# Altium schematic sheet Sheet2.SchDoc: Ultrasonic Distance Meter
size A4; Date: 29.08.2025; Author: Olexandr Makedonskyi; CompanyName: AJAX; DrawnBy: Olexandr Makedonskyi; DocumentNumber: 1; Revision: 1.0; SheetNumber: 1; SheetTotal: 1
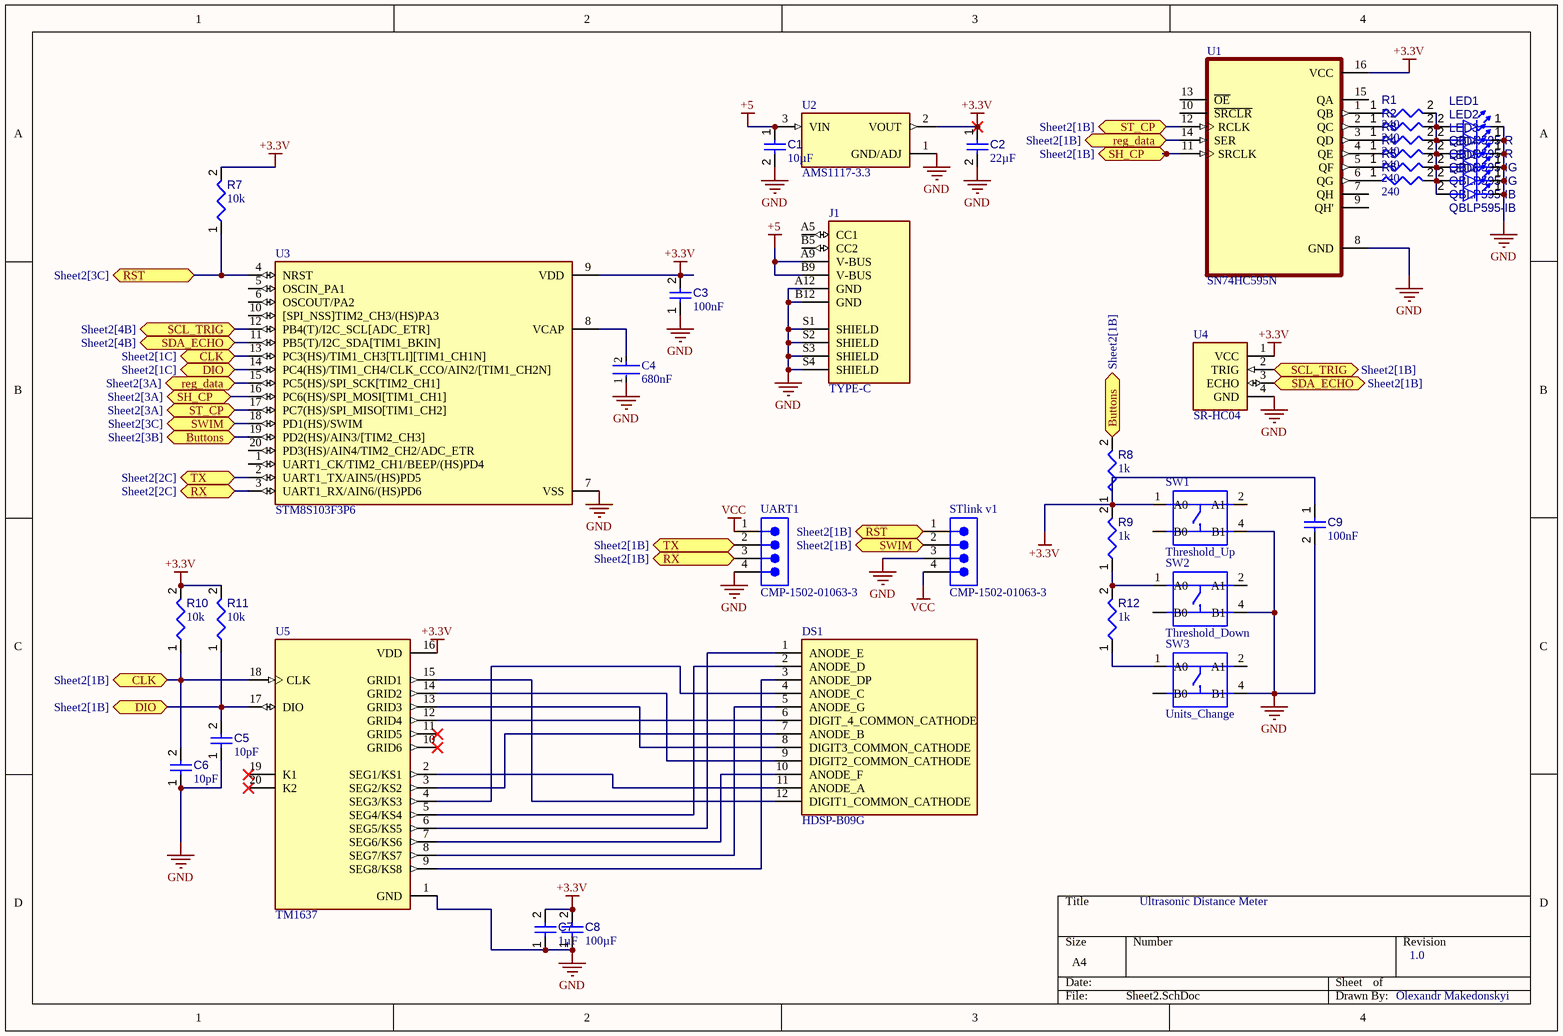
[diagram p0: Sheet2.SchDoc]

## Parts
C1  value 10µF  [CAPC2013X135X45NL10T25]  (hidden comment: Capacitor 10 uF +/- 10% 16 V 0805)
C2  value 22µF  [CAPC0805(2012)145_L]  (hidden comment: Capacitor 22µF +/-40% 16V 0805)
C3  value 100nF  [CAPC0402(1005)60_L]  (hidden comment: Capacitor 100nF +/-20% 10V 0402)
C4  680nF  [FP-C1608-080-0_1-IPC_B]
C5  value 10pF  [CAPC1608X87X35NL15T15]  (hidden comment: Capacitor 10 pF +/- 0.25 pF 50 V 0603)
C6  value 10pF  [CAPC1608X87X35NL15T15]  (hidden comment: Capacitor 10 pF +/- 0.25 pF 50 V 0603)
C7  value 1µF  [CAPC0603(1608)100_L]  (hidden comment: Capacitor 1µF +/-0.1% 25V 0603)
C8  value 100µF  [CAPC0805(2012)145_L]  (hidden comment: Capacitor 100µF +/-20% 6.3V 0805)
C9  value 100nF  [CAPC0402(1005)60_L]  (hidden comment: Capacitor 100nF +/-20% 10V 0402)
DS1  HDSP-B09G  [AVAGO_HDSP-B09G]
J1  TYPE-C  [CUI_UJC-HP-3-SMT-TR]
LED1  QBLP595-R  [QTB-QBLP595_V]
LED2  QBLP595-R  [QTB-QBLP595_V]
LED3  QBLP595-IG  [QTB-QBLP595_V]
LED4  QBLP595-IG  [QTB-QBLP595_V]
LED5  QBLP595-IB  [QTB-QBLP595_V]
LED6  QBLP595-IB  [QTB-QBLP595_V]
R1  value 240  [RESC0402(1005)_L]  (hidden comment: Resistor 240R +/-5 % 0402 63 mW)
R2  value 240  [RESC0402(1005)_L]  (hidden comment: Resistor 240R +/-5 % 0402 63 mW)
R3  value 240  [RESC0402(1005)_L]  (hidden comment: Resistor 240R +/-5 % 0402 63 mW)
R4  value 240  [RESC0402(1005)_L]  (hidden comment: Resistor 240R +/-5 % 0402 63 mW)
R5  value 240  [RESC0402(1005)_L]  (hidden comment: Resistor 240R +/-5 % 0402 63 mW)
R6  value 240  [RESC0402(1005)_L]  (hidden comment: Resistor 240R +/-5 % 0402 63 mW)
R7  value 10k  [RESC0402(1005)_L]  (hidden comment: 10KR2F)
R8  value 1k  [RESC0402(1005)_L]  (hidden comment: 1KR2J)
R9  value 1k  [RESC0402(1005)_L]  (hidden comment: 1KR2J)
R10  value 10k  [RESC3216X60X45ML15T20]  (hidden comment: Resistor 10k +/-1% 1206 250 mW)
R11  value 10k  [RESC3216X60X45ML15T20]  (hidden comment: Resistor 10k +/-1% 1206 250 mW)
R12  value 1k  [RESC0402(1005)_L]  (hidden comment: 1KR2J)
STlink_v1  CMP-1502-01063-3  [61300411021]
SW1  Threshold_Up  [SW4-SMD-5.2X5.2X1.5MM]
SW2  Threshold_Down  [SW4-SMD-5.2X5.2X1.5MM]
SW3  Units_Change  [SW4-SMD-5.2X5.2X1.5MM]
U1  SN74HC595N  [DIP794W45P254L1969H508Q16]
U2  AMS1117-3.3  [SOT229P700X180-4N]
U3  STM8S103F3P6  [SOP65P640X120-20N]
U4  SR-HC04  [MODULE_4007]
U5  TM1637  [DIP778W43P254L2612H431Q20N]
UART1  CMP-1502-01063-3  [61300411021]

## Ports
Buttons (bidir, see Sheet2[1B]), Buttons (bidir, see Sheet2[3B]), CLK (bidir, see Sheet2[1B]), CLK (bidir, see Sheet2[1C]), DIO (bidir, see Sheet2[1B]), DIO (bidir, see Sheet2[1C]), reg_data (bidir, see Sheet2[1B]), reg_data (bidir, see Sheet2[3A]), RST (bidir, see Sheet2[1B]), RST (bidir, see Sheet2[3C]), RX (bidir, see Sheet2[1B]), RX (bidir, see Sheet2[2C]), SCL_TRIG (bidir, see Sheet2[1B]), SCL_TRIG (bidir, see Sheet2[4B]), SDA_ECHO (bidir, see Sheet2[1B]), SDA_ECHO (bidir, see Sheet2[4B]), SH_CP (bidir, see Sheet2[1B]), SH_CP (bidir, see Sheet2[3A]), ST_CP (bidir, see Sheet2[1B]), ST_CP (bidir, see Sheet2[3A]), SWIM (bidir, see Sheet2[1B]), SWIM (bidir, see Sheet2[3C]), TX (bidir, see Sheet2[1B]), TX (bidir, see Sheet2[2C])

## Nets
+3.3V: C2.1 C3.2 C7.2 C8.2 C9.1 R7.2 R8.1 R9.2 R10.2 R11.2 SW1.1(A0) U1.16(VCC) U2.2(VOUT) U3.9(VDD) U4.1(VCC) U5.16(VDD)
+5: C1.1 J1.A9(V-BUS) J1.B9(V-BUS) U2.3(VIN)
GND: C1.2 C2.2 C3.1 C4.1 C5.1 C6.1 C7.1 C8.1 C9.2 J1.A12(GND) J1.B12(GND) J1.S1(SHIELD) J1.S2(SHIELD) J1.S3(SHIELD) J1.S4(SHIELD) LED1.1(K) LED2.1(K) LED3.1(K) LED4.1(K) LED5.1(K) LED6.1(K) STlink_v1.3 SW1.4(B1) SW2.4(B1) SW3.4(B1) U1.8(GND) U2.1(GND/ADJ) U3.7(VSS) U4.4(GND) U5.1(GND) UART1.4
VCC: STlink_v1.4 UART1.1
Buttons: R8.2 U3.19(PD2(HS)/AIN3/[TIM2_CH3]) ; port Buttons
CLK: C6.2 R10.1 U3.13(PC3(HS)/TIM1_CH3[TLI][TIM1_CH1N]) U5.18(CLK) ; port CLK
DIO: C5.2 R11.1 U3.14(PC4(HS)/TIM1_CH4/CLK_CCO/AIN2/[TIM1_CH2N]) U5.17(DIO) ; port DIO
reg_data: U1.14(SER) U3.15(PC5(HS)/SPI_SCK[TIM2_CH1]) ; port reg_data
RST: R7.1 STlink_v1.1 U3.4(NRST) ; port RST
RX: U3.3(UART1_RX/AIN6/(HS)PD6) UART1.3 ; port RX
SCL_TRIG: U3.12(PB4(T)/I2C_SCL[ADC_ETR]) U4.2(TRIG) ; port SCL_TRIG
SDA_ECHO: U3.11(PB5(T)/I2C_SDA[TIM1_BKIN]) U4.3(ECHO) ; port SDA_ECHO
SH_CP: U1.11(SRCLK) U3.16(PC6(HS)/SPI_MOSI[TIM1_CH1]) ; port SH_CP
ST_CP: U1.12(RCLK) U3.17(PC7(HS)/SPI_MISO[TIM1_CH2]) ; port ST_CP
SWIM: STlink_v1.2 U3.18(PD1(HS)/SWIM) ; port SWIM
TX: U3.2(UART1_TX/AIN5/(HS)PD5) UART1.2 ; port TX
NetC4_2: C4.2 U3.8(VCAP)
NetDS1_1: DS1.1(ANODE_E) U5.6(SEG5/KS5)
NetDS1_2: DS1.2(ANODE_D) U5.5(SEG4/KS4)
NetDS1_3: DS1.3(ANODE_DP) U5.9(SEG8/KS8)
NetDS1_4: DS1.4(ANODE_C) U5.4(SEG3/KS3)
NetDS1_5: DS1.5(ANODE_G) U5.8(SEG7/KS7)
NetDS1_6: DS1.6(DIGIT_4_COMMON_CATHODE) U5.12(GRID4)
NetDS1_7: DS1.7(ANODE_B) U5.3(SEG2/KS2)
NetDS1_8: DS1.8(DIGIT3_COMMON_CATHODE) U5.13(GRID3)
NetDS1_9: DS1.9(DIGIT2_COMMON_CATHODE) U5.14(GRID2)
NetDS1_10: DS1.10(ANODE_F) U5.7(SEG6/KS6)
NetDS1_11: DS1.11(ANODE_A) U5.2(SEG1/KS1)
NetDS1_12: DS1.12(DIGIT1_COMMON_CATHODE) U5.15(GRID1)
NetLED1_2: LED1.2(A) LED2.2(A) LED3.2(A) LED4.2(A) LED5.2(A) LED6.2(A) R1.2 R2.2 R3.2 R4.2 R5.2 R6.2
NetR1_1: R1.1 U1.1(QB)
NetR2_1: R2.1 U1.2(QC)
NetR3_1: R3.1 U1.3(QD)
NetR4_1: R4.1 U1.4(QE)
NetR5_1: R5.1 U1.5(QF)
NetR6_1: R6.1 U1.6(QG)
NetR9_1: R9.1 R12.2 SW2.1(A0)
NetR12_1: R12.1 SW3.1(A0)

Not connected (* = marked no-connect by the designer): J1 A5(CC1) B5(CC2); SW1 2(A1) ?1(B0); SW2 2(A1) ?1(B0); SW3 2(A1) ?1(B0); U1 7(QH) 9(QH') 10(~{SRCLR}) 13(~{OE}) 15(QA); U3 1(UART1_CK/TIM2_CH1/BEEP/(HS)PD4) 5(OSCIN_PA1) 6(OSCOUT/PA2) 10([SPI_NSS]TIM2_CH3/(HS)PA3) 20(PD3(HS)/AIN4/TIM2_CH2/ADC_ETR); U5 10(GRID6)* 11(GRID5)* 19(K1)* 20(K2)*

## Notes on the sheet
- Ultrasonic Distance Meter
- 1.0
- Olexandr Makedonskyi

## Library data of the parts
C1 = CMP-001-00015-6: Chip Capacitor, 10 uF, +/- 10%, 16 V, 0805 (2012 Metric); Voltage Rating: 16V; Capacitor Type: Ceramic; RoHS Compliant: True; Max Operating Temperature: 85°C; Min Operating Temperature: -55°C; Mounting Technology: SM; Tolerance: 10%; Case/Package: 0805; Pins: 2
C2 = CMP-001-00081-4: Chip Capacitor, 22µF +/-40%, 16V, 0805, Thickness 1.45 mm; Tolerance: 5%; Voltage Rating: 16V; Mounting Technology: SMT; Pins: 2; Max Operating Temperature: 85°C; Case/Package: 0805; Min Operating Temperature: -55°C
C3 C9 = CMP-001-00061-3: Chip Capacitor, 100nF +/-20%, 10V, 0402, Thickness 0.6 mm; Tolerance: 20%; Mounting Technology: SMT; Voltage Rating: 10V; Max Operating Temperature: 85°C; Pins: 2; Case/Package: 0402; Min Operating Temperature: -55°C
C4 = CMP-08246-004096-1: Multilayer Ceramic Capacitors 680nF ±20% 35V JB SMD 0603; Packaging: Tape and Reel; Case/Package: 0603; Mount: Surface Mount; Width: 0.031inch; Length: 0.063inch; Min Operating Temperature: -25°C; Series: C; RoHS Compliant: Yes; Lead Free: Lead Free; Max Operating Temperature: 85°C; Case Code (Imperial): 0603; Thickness: 0.035inch; Voltage Rating: 35V; Case Code (Metric): 1608; Dielectric Material: Ceramic; Tolerance: 20%; Package Quantity: 4000; Capacitance: 680nF; Voltage Rating (DC): 35V
C5 C6 = CMP-001-00012-6: Chip Capacitor, 10 pF, +/- 0.25 pF, 50 V, 0603 (1608 Metric); Tolerance: 0.25%; Capacitor Type: Ceramic; Voltage Rating: 50V; Max Operating Temperature: 125°C; RoHS Compliant: True; Mounting Technology: SM; Pins: 2; Case/Package: 0603; Min Operating Temperature: -55°C
C7 = CMP-001-00055-4: Chip Capacitor, 1µF +/-0.1%, 25V, 0603, Thickness 1 mm; Tolerance: 20%; Min Operating Temperature: -55°C; Max Operating Temperature: 85°C; Voltage Rating: 25V; Mounting Technology: SMT; Case/Package: 0603; Pins: 2
C8 = CMP-001-00054-4: Chip Capacitor, 100µF +/-20%, 6.3V, 0805, Thickness 1.45 mm; Tolerance: 10%; Min Operating Temperature: -55°C; Max Operating Temperature: 85°C; Pins: 2; Mounting Technology: SMT; Case/Package: 0805; Voltage Rating: 6.3V
DS1 = CMP-007-00036-1: Display Modules - LED Character and Numeric Green 7-Segment Clock 4 Character Common Cathode 2.2V 20mA 0.752 H x 2.016 W x 0.315 D (19.10mm x 51.20mm x 8.00mm) 12-DIP (0.600, 15.24mm); MF: Broadcom / Avago; Check_prices: https://www.snapeda.com/parts/HDSP-B09G/Broadcom/view-part/?ref=eda; SnapEDA_Link: https://www.snapeda.com/parts/HDSP-B09G/Broadcom/view-part/?ref=snap; MP: HDSP-B09G; Pins: 12; Value: *; Design Item ID: HDSP-B09G; Component Type: Standard; Case/Package: None; Source: HDSP-B09G.SchLib
J1 = CMP-021-000000-1: Source: UJC-HP-3-SMT-TR.SchLib; Design Item ID: UJC-HP-3-SMT-TR; Value: *; Package: None; MP: UJC-HP-3-SMT-TR; Availability: Unavailable; Pin Count: 10; Component Type: Standard; Price: None
LED1 LED2 = CMP-007-00040-3: Chip LED 0402, Red, 0.02 A, 2.0 to 2.5 V, -40 to 80 degC, 2-Pin SMD, RoHS, Tape and Reel; Colour: Red; RoHS Compliant: Yes; Case/Package: 0402; Pins: 2; Mounting Technology: SMT
LED3 LED4 = CMP-007-00041-3: Chip LED 0402, Green, 0.02 A, 3.1 to 3.7 V, -40 to 80 degC, 2-Pin SMD, RoHS, Tape and Reel; Case/Package: 0402; Colour: Green; Mounting Technology: SMT; Pins: 2; RoHS Compliant: Yes
LED5 LED6 = CMP-007-00042-3: Chip LED 0402, Blue, 0.02 A, 3.1 to 3.7 V, -40 to 80 degC, 2-Pin SMD, RoHS, Tape and Reel; RoHS Compliant: Yes; Colour: Blue; Pins: 2; Case/Package: 0402; Mounting Technology: SMT
R1-R6 = CMP-009-00155-3: Chip Resistor, 240 Ohms, +/-5 %, 63 mW, -55 to 155 degC, 0402; Power: 63mW; Tolerance: 5%; Case/Package: 0402; Pins: 2; Max Operating Temperature: 155°C; Min Operating Temperature: -55°C
R7 = CMP-009-00066-2: 10K 0.063W 1% 0402 (1005 Metric)  SMD; Power: 63mW; Case/Package: 0402; Mounting Technology: SMT; Pins: 2; Tolerance: 1%
R8 R9 R12 = CMP-009-00075-2: 1K 0.063W 5% 0402 (1005 Metric)  SMD; Power: 63mW; Pins: 2; Mounting Technology: SMT; Case/Package: 0402; Tolerance: 5%
R10 R11 = CMP-009-00016-5: Chip Resistor, 10 KOhm, +/- 1%, 0.25 W, -55 to 155 degC, 1206 (3216 Metric); Power: 250mW; Voltage Rating: 200V; Pins: 2; Max Operating Temperature: 155°C; Tolerance: 1%; RoHS Compliant: True; Case/Package: 1206; Min Operating Temperature: -55°C; Mounting Technology: SM
STlink_v1 UART1 = CMP-007-000000-1: NexarPartId: 31153320; Number of Positions: 4; Connector Type: Male Pin; Gender: Male; Current Rating: 3A; Pitch: 2.54mm; Contact Resistance: 20m?; Operating Supply Voltage: 250V; REACH SVHC: Unknown; Contact Mating Length: 5.9944mm; Termination: Solder; Pin Count: 4; Mount: Through Hole; Number of Rows: 1; Number of Pins: 4; Contact Material: Copper; Color: Black; Contact Plating: Gold; Design Item ID: CMP-1502-01063-3; Component Type: Standard; Source: Components - 25.08.25 - 11.48.SchLib; RoHS: Compliant; Lead Pitch: 2.54mm; Number of Contacts: 4
SW1-SW3 = CMP-011-00013-1: Switch Tactile N.O. SPST Button Gull Wing 0.05A 12VDC 3.43N SMD T/R; MF: ALPS; MP: SKQGAKE010; Price: None; Pins: 4; SnapEDA_Link: https://www.snapeda.com/parts/SKQGAKE010/ALPS/view-part/51324/?ref=snap; Source: SnapEDAsch.SchLib; Value: *; Availability: Unavailable; Design Item ID: SMD-BUTTON(4P-5.2X5.2X1.5MM-SKQGAKE010); Component Type: Standard; Case/Package: None
U1 = CMP-009-000000-1: 8-bit shift registers with 3-state output registers; MF: Texas Instruments; MP: SN74HC595N; Component Type: Standard; Package: PDIP-16 Texas Instruments; Check_prices: https://www.snapeda.com/parts/SN74HC595N/Texas+Instruments/view-part/?ref=eda; Design Item ID: SN74HC595N; SnapEDA_Link: https://www.snapeda.com/parts/SN74HC595N/Texas+Instruments/view-part/?ref=snap; Pin Count: 16; Value: *; Source: SN74HC595N.SchLib
U2 = CMP-014-00002-1: Sot223/Pkg 1-Amp 3.3-Volt Low Drop Out Voltage Regulatator; MF: Advanced Monolithic Systems; Value: *; SnapEDA_Link: https://www.snapeda.com/parts/AMS1117-3.3/Advanced+Monolithic+Systems/view-part/?ref=snap; Source: AMS1117-3.3.SchLib; MP: AMS1117-3.3; Component Type: Standard; Case/Package: SOT-223 Seeed Technology; Check_prices: https://www.snapeda.com/parts/AMS1117-3.3/Advanced+Monolithic+Systems/view-part/?ref=eda; Pins: 3; Design Item ID: AMS1117-3.3
U3 = CMP-031-00006-1: STM8 series Microcontroller IC 8-Bit 16MHz 8KB (8K x 8) FLASH 20-TSSOP; MF: STMicroelectronics; Check_prices: https://www.snapeda.com/parts/STM8S103F3P6/STMicroelectronics/view-part/?ref=eda; Value: *; Design Item ID: STM8S103F3P6; Component Type: Standard; SnapEDA_Link: https://www.snapeda.com/parts/STM8S103F3P6/STMicroelectronics/view-part/?ref=snap; Case/Package: TSSOP-20 STMicroelectronics; MP: STM8S103F3P6; Pins: 20; Source: STM8S103F3P6.SchLib
U4 = CMP-015-000000-1: Ultrasonic Distance Sensor - 3V or 5V - HC-SR04 compatible - RCWL-1601; MF: Adafruit Industries; MP: 4007; Package: None; Value: *; Component Type: Standard; Pin Count: 4; Design Item ID: 4007; Source: 4007.SchLib; Check_prices: https://www.snapeda.com/parts/4007/Adafruit+Industries+LLC/view-part/?ref=eda; SnapEDA_Link: https://www.snapeda.com/parts/4007/Adafruit+Industries+LLC/view-part/?ref=snap
U5 = CMP-005-000000-1: LED Drive Control Special Circuit; MF: Titan Micro Electronics; Check_prices: https://www.snapeda.com/parts/TM1637/Titan+Micro+Electronics/view-part/?ref=eda; Package: None; Source: TM1637.SchLib; SnapEDA_Link: https://www.snapeda.com/parts/TM1637/Titan+Micro+Electronics/view-part/?ref=snap; Design Item ID: TM1637; Component Type: Standard; Pin Count: 20; Value: *; MP: TM1637